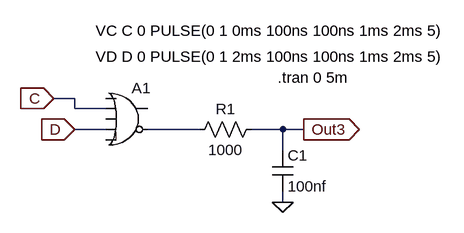
[diagram p0: schematic Lab2Part3.asc]
Lab2Part3.asc, the LTspice schematic file:
Version 4
SHEET 1 880 680
WIRE 0 96 -32 96
WIRE 0 112 0 96
WIRE 48 112 0 112
WIRE 48 144 0 144
WIRE 192 144 112 144
WIRE 320 144 272 144
WIRE 352 144 320 144
WIRE 320 176 320 144
WIRE 320 256 320 240
FLAG 320 256 0
FLAG -32 96 C
IOPIN -32 96 In
FLAG 0 144 D
IOPIN 0 144 In
FLAG 352 144 Out3
IOPIN 352 144 Out
SYMBOL Digital\\or 80 64 R0
SYMATTR InstName A1
SYMBOL res 288 128 R90
WINDOW 0 0 56 VBottom 2
WINDOW 3 32 56 VTop 2
SYMATTR InstName R1
SYMATTR Value 1000
SYMBOL cap 304 176 R0
SYMATTR InstName C1
SYMATTR Value 100nf
TEXT 32 -8 Left 2 !VC C 0 PULSE(0 1 0ms 100ns 100ns 1ms 2ms 5)
TEXT 32 32 Left 2 !VD D 0 PULSE(0 1 2ms 100ns 100ns 1ms 2ms 5)
TEXT 312 64 Left 2 !.tran 0 5m

The netlist it stands for:
* Lab2Part3.asc
A1 0 C 0 D 0 N001 0 0 OR
R1 Out3 N001 1000
C1 Out3 0 100nf
VC C 0 PULSE(0 1 0ms 100ns 100ns 1ms 2ms 5)
VD D 0 PULSE(0 1 2ms 100ns 100ns 1ms 2ms 5)
.tran 0 5m
.backanno
.end

* Results of the author's LTspice run, read from the files saved beside the schematic
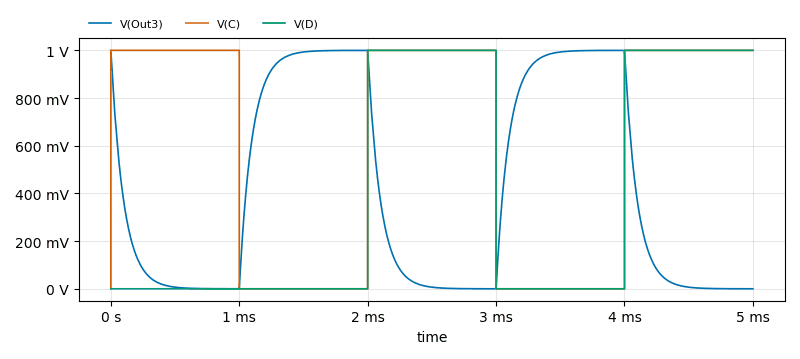
[diagram p1: Transient Analysis of Lab2Part3.asc, plotted from the saved traces]
* Transient Analysis, 1 run:
*   V(Out3): min 45.72 µV, max 1 V, average 420.2 mV, rms 608.8 mV, last 45.79 µV
*   V(C): min 0 V, max 1 V, average 600 mV, rms 774.6 mV, last 1 V
*   V(D): min 0 V, max 1 V, average 400 mV, rms 632.5 mV, last 1 V